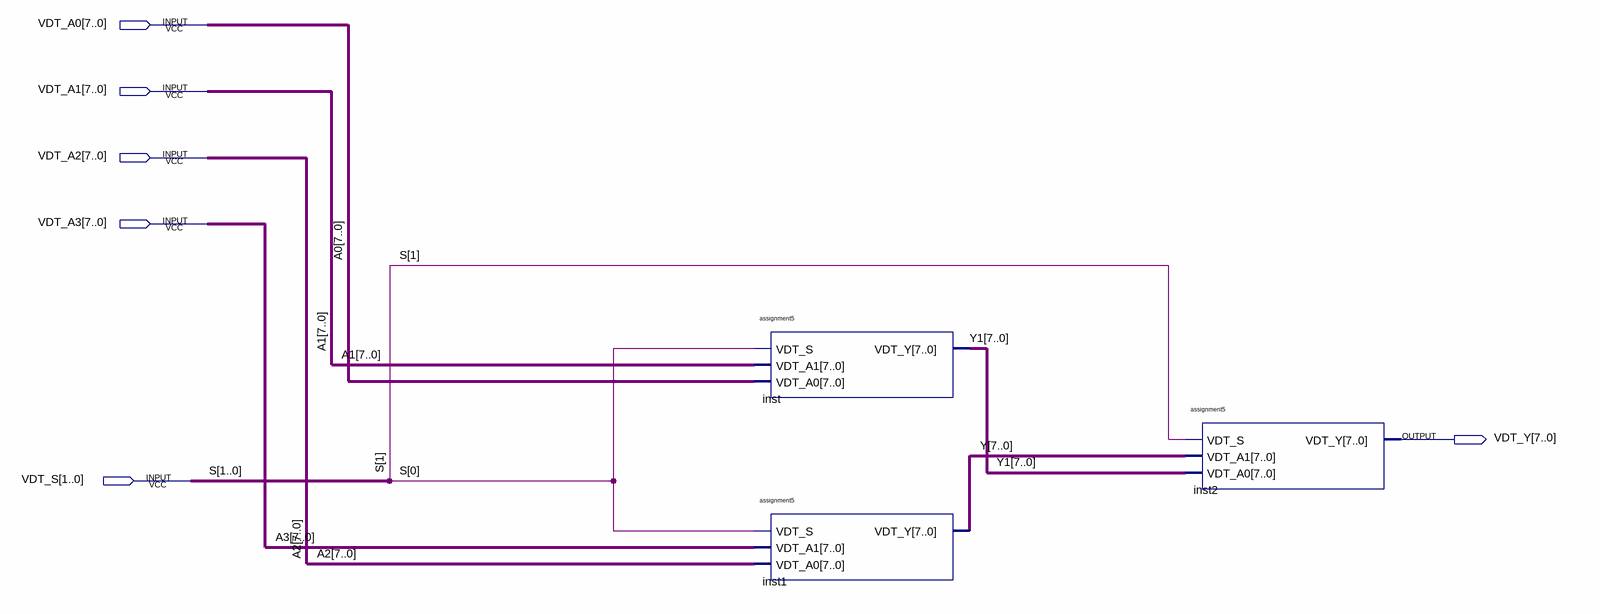
[diagram p0: schematic sheet]
// Quartus schematic assignment6.bdf as structural Verilog: 3 symbols, 6 pins
module assignment6 (
  input  [7:0] VDT_A0,
  input  [7:0] VDT_A1,
  input  [7:0] VDT_A2,
  input  [7:0] VDT_A3,
  input  [1:0] VDT_S,
  output [7:0] VDT_Y
);

  wire [7:0] Y, Y1;

  assignment5 inst (.VDT_S(VDT_S[0]), .VDT_A1(VDT_A1), .VDT_A0(VDT_A0), .VDT_Y(Y1));
  assignment5 inst1 (.VDT_S(VDT_S[0]), .VDT_A1(VDT_A3), .VDT_A0(VDT_A2), .VDT_Y(Y));
  assignment5 inst2 (.VDT_S(VDT_S[1]), .VDT_A1(Y), .VDT_A0(Y1), .VDT_Y(VDT_Y));

  // Other names for the same wires on the sheet: S[1:0] = VDT_S; A0[7:0] = VDT_A0; A1[7:0] = VDT_A1; A2[7:0] = VDT_A2;
  //   A3[7:0] = VDT_A3
endmodule
